# EAGLE design board (EAGLE 7.7.0)
CNAME: SCALE target board; CREVISION: A.1; DESIGNER: Daniel Page
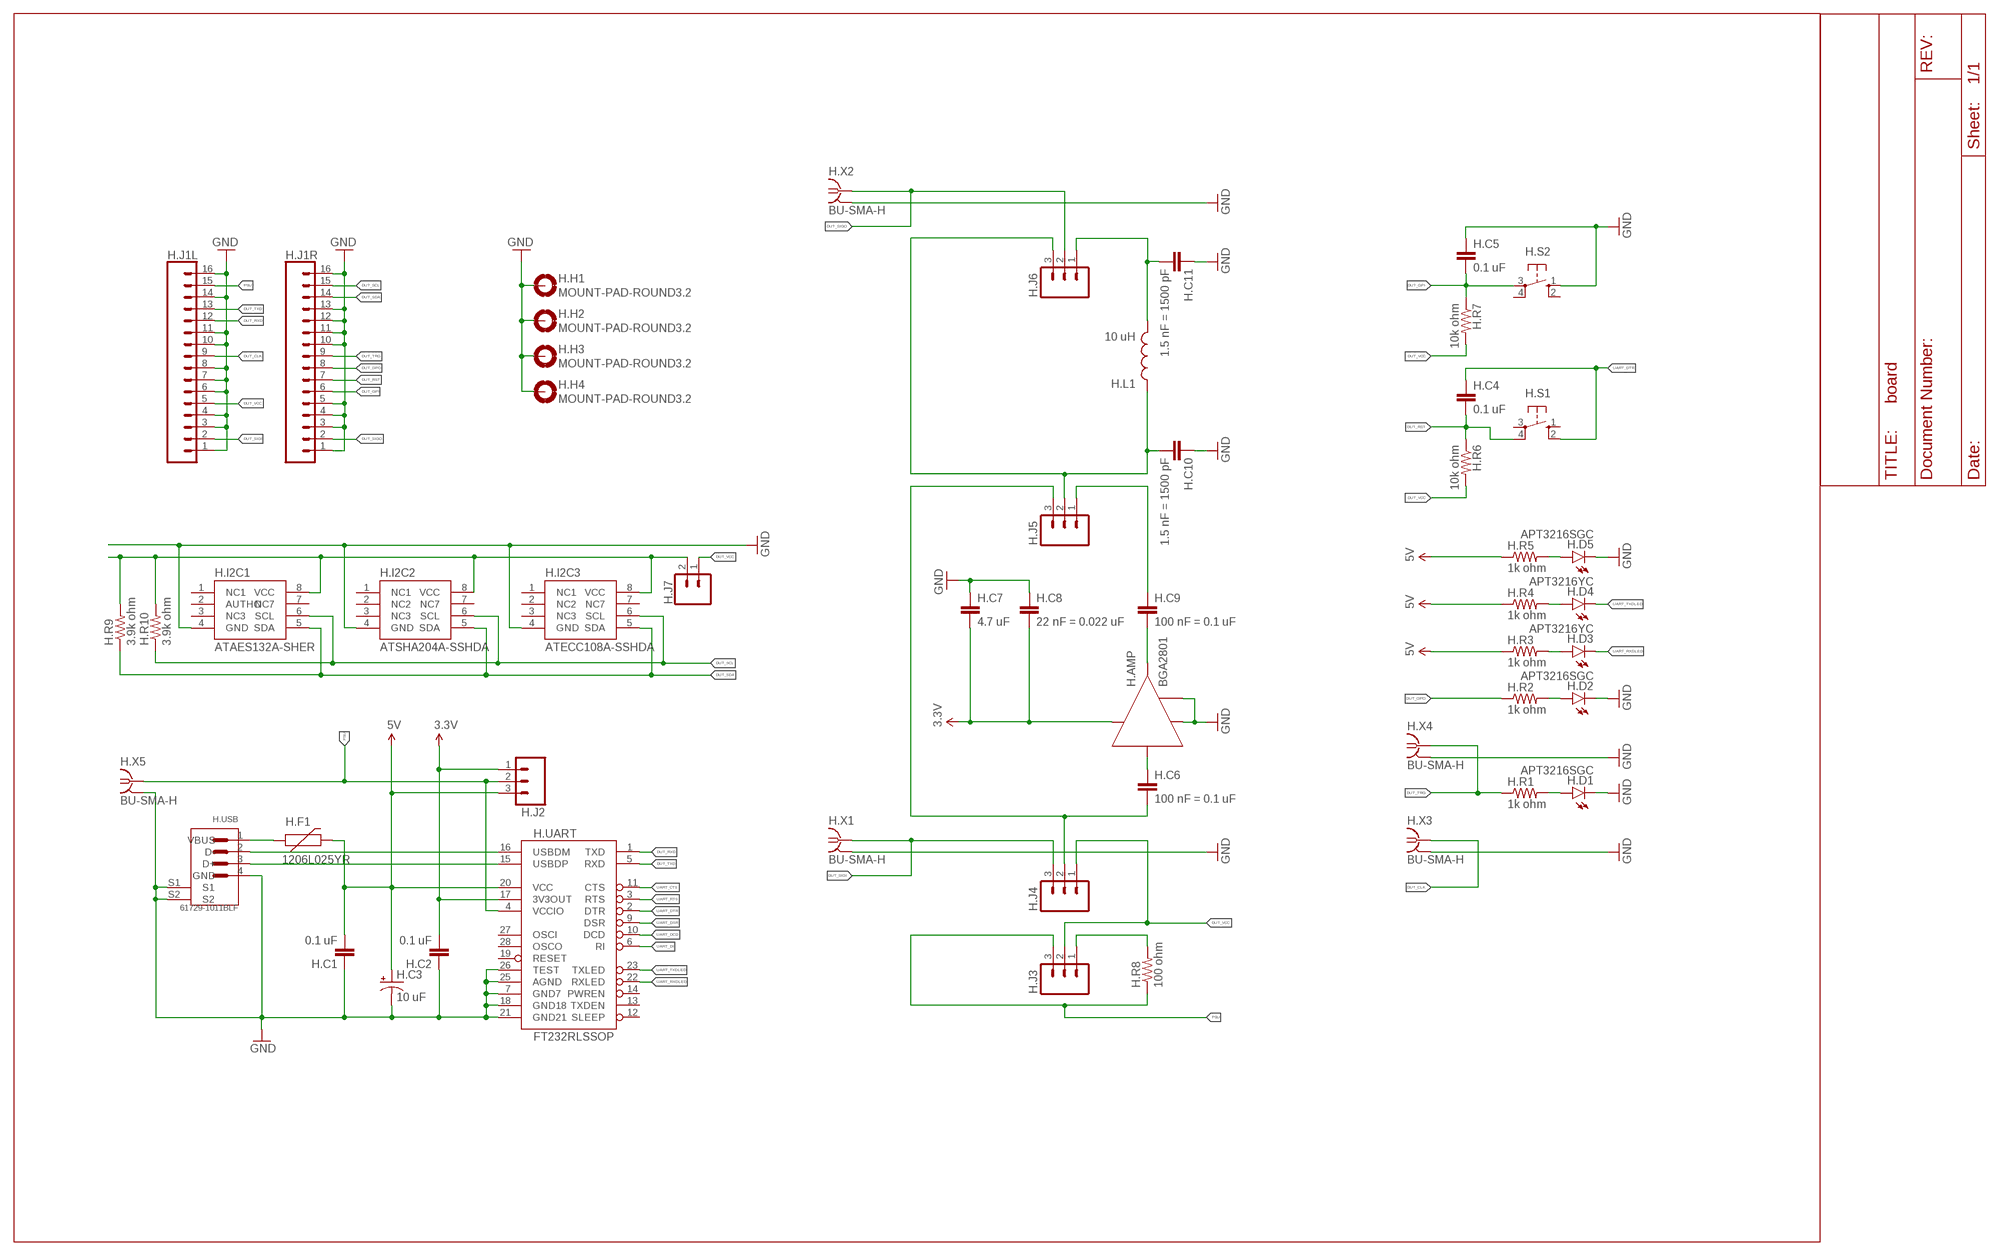
[diagram p0: schematic, sheet 1]

## Parts
H.AMP  BGA2801  [SOT363]
H.C1  0.1 uF  CAP0603-CAP  [0603-CAP]
H.C2  0.1 uF  CAP0603-CAP  [0603-CAP]
H.C3  10 uF  CAP_POL1206  [EIA3216]
H.C4  0.1 uF  CAP0603-CAP  [0603-CAP]
H.C5  0.1 uF  CAP0603-CAP  [0603-CAP]
H.C6  100 nF = 0.1 uF  CAP0603-CAP  [0603-CAP]
H.C7  4.7 uF  CAP0603-CAP  [0603-CAP]
H.C8  22 nF = 0.022 uF  CAP0603-CAP  [0603-CAP]
H.C9  100 nF = 0.1 uF  CAP0603-CAP  [0603-CAP]
H.C10  1.5 nF = 1500 pF  CAP0603-CAP  [0603-CAP]
H.C11  1.5 nF = 1500 pF  CAP0603-CAP  [0603-CAP]
H.D1  APT3216SGC  LED-GREEN1206  [LED-1206]
H.D2  APT3216SGC  LED-GREEN1206  [LED-1206]
H.D3  APT3216YC  LED-YELLOW1206  [LED-1206]
H.D4  APT3216YC  LED-YELLOW1206  [LED-1206]
H.D5  APT3216SGC  LED-RED1206  [LED-1206]
H.F1  1206L025YR  PTCSMD  [PTC-1206]
H.H1  MOUNT-PAD-ROUND3.2  [3,2-PAD]
H.H2  MOUNT-PAD-ROUND3.2  [3,2-PAD]
H.H3  MOUNT-PAD-ROUND3.2  [3,2-PAD]
H.H4  MOUNT-PAD-ROUND3.2  [3,2-PAD]
H.I2C1  ATAES132A-SHER  ATAES132  [SO08]
H.I2C2  ATSHA204A-SSHDA  ATSHA204_SOIC8  [SO08]
H.I2C3  ATECC108A-SSHDA  ATECC108  [SO08]
H.J1L  CONN_16  [1X16]
H.J1R  CONN_16  [1X16]
H.J2  M03PTH  [1X03@1]
H.J3  M03PTH  [1X03@1]
H.J4  M03PTH  [1X03@1]
H.J5  M03PTH  [1X03@1]
H.J6  M03PTH  [1X03@1]
H.J7  CONN_02  [1X02]
H.L1  10 uH  INDUCTOR0603  [0603]
H.R1  1k ohm  RESISTOR0603-RES  [0603-RES]
H.R2  1k ohm  RESISTOR0603-RES  [0603-RES]
H.R3  1k ohm  RESISTOR0603-RES  [0603-RES]
H.R4  1k ohm  RESISTOR0603-RES  [0603-RES]
H.R5  1k ohm  RESISTOR0603-RES  [0603-RES]
H.R6  10k ohm  RESISTOR0603-RES  [0603-RES]
H.R7  10k ohm  RESISTOR0603-RES  [0603-RES]
H.R8  100 ohm  RESISTOR0603-RES  [0603-RES]
H.R9  3.9k ohm  RESISTOR0603-RES  [0603-RES]
H.R10  3.9k ohm  RESISTOR0603-RES  [0603-RES]
H.S1  40-XX  [B3F-40XX]
H.S2  40-XX  [B3F-40XX]
H.UART  FT232RLSSOP  [SSOP28DB]
H.USB  61729-1011BLF  [FCI_61729-1011BLF]
H.X1  BU-SMA-H  [BU-SMA-H]
H.X2  BU-SMA-H  [BU-SMA-H]
H.X3  BU-SMA-H  [BU-SMA-H]
H.X4  BU-SMA-H  [BU-SMA-H]
H.X5  BU-SMA-H  [BU-SMA-H]

## Nets
3.3V: H.AMP.1(VCC) H.C2.2 H.C7.2 H.C8.2 H.J2.1 H.UART.17(3V3OUT)
5V: H.C1.2 H.C3.A(+) H.F1.2 H.J2.3 H.R3.1 H.R4.1 H.R5.1 H.UART.20(VCC)
AMP: H.AMP.3(RF_OUT) H.C9.2
DUT_CLK: H.J1L.9 H.X3.1
DUT_GPI: H.C5.2 H.J1R.6 H.R7.1 H.S2.3(P)
DUT_GPO: H.J1R.8 H.R2.1
DUT_RST: H.C4.2 H.J1R.7 H.R6.1 H.S1.4(P1)
DUT_RXD: H.J1L.12 H.UART.1(TXD)
DUT_SCL: H.I2C1.6(SCL) H.I2C2.6(SCL) H.I2C3.6(SCL) H.J1R.15 H.R10.1
DUT_SDA: H.I2C1.5(SDA) H.I2C2.5(SDA) H.I2C3.5(SDA) H.J1R.14 H.R9.1
DUT_SIGI: H.J1L.2 H.J4.3 H.X1.1
DUT_SIGO: H.J1R.2 H.J6.2 H.X2.1
DUT_TRG: H.J1R.9 H.R1.1 H.X4.1
DUT_TXD: H.J1L.13 H.UART.5(RXD)
DUT_VCC: H.J1L.5 H.J3.2 H.J4.1 H.J7.1 H.R6.2 H.R7.2
GND: H.AMP.2(GND2) H.AMP.4(GND1) H.AMP.5(GND2) H.C1.1 H.C2.1 H.C3.C(-) H.C5.1 H.C7.1 H.C8.1 H.C10.1 H.C11.1 H.D1.C H.D2.C H.D5.C H.H1.B3,2(MOUNT) H.H2.B3,2(MOUNT) H.H3.B3,2(MOUNT) H.H4.B3,2(MOUNT) H.I2C1.4(GND) H.I2C2.4(GND) H.I2C3.4(GND) H.J1L.1 H.J1L.3 H.J1L.4 H.J1L.6 H.J1L.7 H.J1L.8 H.J1L.10 H.J1L.11 H.J1L.14 H.J1L.16 H.J1R.1 H.J1R.3 H.J1R.4 H.J1R.5 H.J1R.10 H.J1R.11 H.J1R.12 H.J1R.13 H.J1R.16 H.S2.1(S) H.UART.7(GND7) H.UART.18(GND18) H.UART.21(GND21) H.UART.25(AGND) H.UART.26(TEST) H.USB.4(GND) H.USB.S1 H.USB.S2 H.X1.2 H.X1.3 H.X1.4 H.X1.5 H.X2.2 H.X2.3 H.X2.4 H.X2.5 H.X3.2 H.X3.3 H.X3.4 H.X3.5 H.X4.2 H.X4.3 H.X4.4 H.X4.5 H.X5.2 H.X5.3 H.X5.4 H.X5.5
N$1: H.D5.A H.R5.2
N$2: H.D4.A H.R4.2
N$3: H.D3.A H.R3.2
N$6: H.D1.A H.R1.2
N$7: H.D2.A H.R2.2
N$9: H.UART.16(USBDM) H.USB.2(D-)
N$10: H.UART.15(USBDP) H.USB.3(D+)
N$13: H.C9.1 H.J5.1
N$14: H.C11.2 H.J6.1 H.L1.2
N$15: H.C10.2 H.J5.2 H.J6.3 H.L1.1
N$16: H.J3.1 H.R8.2
N$18: H.F1.1 H.USB.1(VBUS)
N$19: H.I2C1.8(VCC) H.I2C2.8(VCC) H.I2C3.8(VCC) H.J7.2 H.R9.2 H.R10.2
N$21: H.AMP.6(RF_IN) H.C6.1
N$25: H.C6.2 H.J4.2 H.J5.3
PSU: H.J1L.15 H.J2.2 H.J3.3 H.R8.1 H.UART.4(VCCIO) H.X5.1
UART_CTS: H.UART.11(CTS)
UART_DCD: H.UART.10(DCD)
UART_DI: H.UART.6(RI)
UART_DSR: H.UART.9(DSR)
UART_DTR: H.C4.1 H.S1.2(S1) H.UART.2(DTR)
UART_RTS: H.UART.3(RTS)
UART_RXDLED: H.D3.C H.UART.22(RXLED)
UART_TXDLED: H.D4.C H.UART.23(TXLED)
Unconnected: H.I2C1.1(NC1) H.I2C1.2(AUTHO) H.I2C1.3(NC3) H.I2C1.7(NC7) H.I2C2.1(NC1) H.I2C2.2(NC2) H.I2C2.3(NC3) H.I2C2.7(NC7) H.I2C3.1(NC1) H.I2C3.2(NC2) H.I2C3.3(NC3) H.I2C3.7(NC7) H.S1.1(S) H.S1.3(P) H.S2.2(S1) H.S2.4(P1) H.UART.12(SLEEP) H.UART.13(TXDEN) H.UART.14(PWREN) H.UART.19(RESET) H.UART.27(OSCI) H.UART.28(OSCO)

## Library data of the parts
H.AMP = board:BGA2801
H.C1 H.C2 H.C4-H.C11 = SparkFun-Capacitors:CAP: Capacitor Standard 0603 ceramic capacitor, and 0.1" leaded capacitor.
H.C3 = SparkFun-Capacitors:CAP_POL: Capacitor Polarized These are standard SMD and PTH capacitors. Normally 10uF, 47uF, and 100uF in electrolytic and tantalum varieties. Always verify the external diameter of the through hole cap, it varies with capacity, voltage, and manufacturer. The EIA devices should be standard.
H.D1 H.D2 = SparkFun-LED:LED-GREEN: Various green LEDs Green LEDs used in SFE Production 0603- DIO-00821 LARGE- DIO-00862 LILYPAD- DIO-09910; PROD_ID: DIO-00862; VALUE: GREEN
H.D3 H.D4 = SparkFun-LED:LED-YELLOW: Yellow SMD LEDs LilyPad 1206- DIO-09909 0603- DIO-09003 "SMART" means more efficient and expensive; PROD_ID: DIO-00820; VALUE: YELLOW
H.D5 = SparkFun-LED:LED-RED: Assorted Red LEDs LilyPad 1206- DIO-09912 1206- DIO-00809 0603- DIO-00819 "SMART" means more efficient and expensive; PROD_ID: DIO-09912; VALUE: RED
H.F1 = SparkFun-PowerIC:PTC: Resettable Fuse PTC Resettable Fuse. Spark Fun Electronics SKU : COM-08357; PROD_ID: RES-11150
H.H1-H.H4 = holes:MOUNT-PAD-ROUND: MOUNTING PAD, round
H.I2C1 = SparkFun-IC-Special-Function:ATAES132: Crypto 32Kb Serial EEPROM AES-128-CCM MAC Secure Storage for 128-bit keys Encrypted User Memory Readn and Write HWRNG 2.5V to 5.5V Datasheet <https://cdn.sparkfun.com/datasheets/Dev/Beagle/Atmel-8760-CryptoAuth-ATAES132-Datasheet.pdf> SparkFun Products CryptoCape <https://www.sparkfun.com/products/12773> (DEV-12773) SparkFun CryptoShield <https://www.sparkfun.com/products/13183> (DEV-13183); PROD_ID: IC-11983; VALUE: ATAES132
H.I2C2 = SparkFun-IC-Special-Function:ATSHA204_SOIC8: Crypto 4.5KB I2C Datasheet <https://cdn.sparkfun.com/datasheets/Dev/Beagle/Atmel-8740-CryptoAuth-ATSHA204-Datasheet.pdf> SparkFun Products CryptoCape <https://www.sparkfun.com/products/12773> (DEV-12773) SparkFun CryptoShield <https://www.sparkfun.com/products/13183> (DEV-13183); PROD_ID: IC-11981; VALUE: ATSHA204
H.I2C3 = SparkFun-IC-Special-Function:ATECC108: ATECC108 ECDSA with NIST ATECC108: Provides ECDSA with NIST curves P256, B283, and K283. Also, a RNG, 8.5Kb EEPROM. 2.0V - 5.5V. Datasheet <https://cdn.sparkfun.com/datasheets/Dev/Beagle/Atmel-8873S-CryptoAuth-ATECC108-Datasheet-Summary.pdf> SparkFun Products CryptoCape <https://www.sparkfun.com/products/12773> (DEV-12773) SparkFun CryptoShield <https://www.sparkfun.com/products/13183> (DEV-13183); PROD_ID: IC-11982; VALUE: ATECC108
H.J1L H.J1R = SparkFun-Connectors:CONN_16: Multi connection point. Often used as Generic Header-pin footprint for 0.1 inch spaced/style header connections On any of the 0.1 inch spaced packages, you can populate with these: Break Away Headers - Straight <https://www.sparkfun.com/products/116> (PRT-00116) Break Away Male Headers - Right Angle <https://www.sparkfun.com/products/553> (PRT-00553) Female Headers <https://www.sparkfun.com/products/115> (PRT-00115) Break Away Headers - Machine Pin <https://www.sparkfun.com/products/117> (PRT-00117) Break Away Female Headers - Swiss Machine Pin <https://www.sparkfun.com/products/743> (PRT-00743) For SCREWTERMINALS and SPRING TERMINALS visit here: Screw Terimnals on SparkFun.com <https://www.sparkfun.com/search/results?term=Screw+Terminals> (5mm/3.5mm/2.54mm spacing) This device is also useful as a general connection point to wire up your design to another part of your project. Our various solder wires solder well into these plated through hole pads. Hook-Up Wire - Assortment (Stranded, 22 AWG) <https://www.sparkfun.com/products/11375> (PRT-11375) Hook-Up Wire - Assortment (Solid Core, 22 AWG) <https://www.sparkfun.com/products/11367> (PRT-11367) View the entire wire category on our website here <https://www.sparkfun.com/categories/141> Special notes: Molex polarized connector foot print use with SKU : PRT-08231 with associated crimp pins and housings. 1MM SMD Version SKU: PRT-10208 NOTES ON THE VARIANTS LOCK and LOCK_LONGPADS... This footprint was designed to help hold the alignment of a through-hole component (i.e. 6-pin header) while soldering it into place. You may notice that each hole has been shifted either up or down by 0.005 of an inch from it's more standard position (which is a perfectly straight line). This slight alteration caused the pins (the squares in the middle) to touch the edges of the holes. Because they are alternating, it causes a "brace" to hold the component in place. 0.005 has proven to be the perfect amount of "off-center" position when using our standard breakaway headers. Although looks a little odd when you look at the bare footprint, once you have a header in there, the alteration is very hard to notice. Also,if you push a header all the way into place, it is covered up entirely on the bottom side.
H.J2-H.J6 = SparkFun-Connectors:M03: Header 3 Standard 3-pin 0.1" header. Use with straight break away headers (SKU : PRT-00116), right angle break away headers (PRT-00553), swiss pins (PRT-00743), machine pins (PRT-00117), and female headers (PRT-00115). Molex polarized connector foot print use with SKU : PRT-08232 with associated crimp pins and housings.
H.J7 = SparkFun-Connectors:CONN_02: Multi connection point. Often used as Generic Header-pin footprint for 0.1 inch spaced/style header connections On any of the 0.1 inch spaced packages, you can populate with these: Break Away Headers - Straight <https://www.sparkfun.com/products/116> (PRT-00116) Break Away Male Headers - Right Angle <https://www.sparkfun.com/products/553> (PRT-00553) Female Headers <https://www.sparkfun.com/products/115> (PRT-00115) Break Away Headers - Machine Pin <https://www.sparkfun.com/products/117> (PRT-00117) Break Away Female Headers - Swiss Machine Pin <https://www.sparkfun.com/products/743> (PRT-00743) For SCREWTERMINALS and SPRING TERMINALS visit here: Screw Terimnals on SparkFun.com <https://www.sparkfun.com/search/results?term=Screw+Terminals> (5mm/3.5mm/2.54mm spacing) This device is also useful as a general connection point to wire up your design to another part of your project. Our various solder wires solder well into these plated through hole pads. Hook-Up Wire - Assortment (Stranded, 22 AWG) <https://www.sparkfun.com/products/11375> (PRT-11375) Hook-Up Wire - Assortment (Solid Core, 22 AWG) <https://www.sparkfun.com/products/11367> (PRT-11367) View the entire wire category on our website here <https://www.sparkfun.com/categories/141> Special notes: Molex polarized connector foot print use with: PRT-08233 with associated crimp pins and housings. 2.54_SCREWTERM for use with PRT-10571. 3.5mm Screw Terminal footprints for PRT-08084 5mm Screw Terminal footprints for use with PRT-08432
H.L1 = SparkFun-Passives:INDUCTOR: Inductors Basic Inductor/Choke - 0603 and 1206. Footprints are not proven and vary greatly between part numbers. INDUCTOR POWER 3.3UH 4.0A SMD 0.197" L x 0.197" W x 0.177" H (5.00mm x 5.00mm x 4.50mm)
H.R1-H.R10 = SparkFun-Passives:RESISTOR: Resistor Basic schematic elements and footprints for 0603, 1206, and PTH resistors.
H.S1 H.S2 = switch-omron:40-XX: OMRON SWITCH; MF: OMRON COMPONENTS USA; MPN: B3F-4000; OC_FARNELL: 176434; OC_NEWARK: 36K3105
H.UART = SparkFun-DigitalIC:FT232RL: USB UART FT232RL 4th Generation USB UART (USB <-> Serial) Controller. Spark Fun Electronics SKU : COM-00650 Production SKU IC-00870; PROD_ID: IC-00870
H.USB = Octopart-CPL:61729-1011BLF: Conn USB Type B RCP 4 POS 2.5mm Solder RA Thru-Hole 4 Terminal 1 Port Tube; MANUFACTURER: Framatome
H.X1-H.X5 = con-coax:BU-SMA-H: FEMALE SMA CONNECTOR Radiall; OC_FARNELL: unknown; OC_NEWARK: unknown

## Board
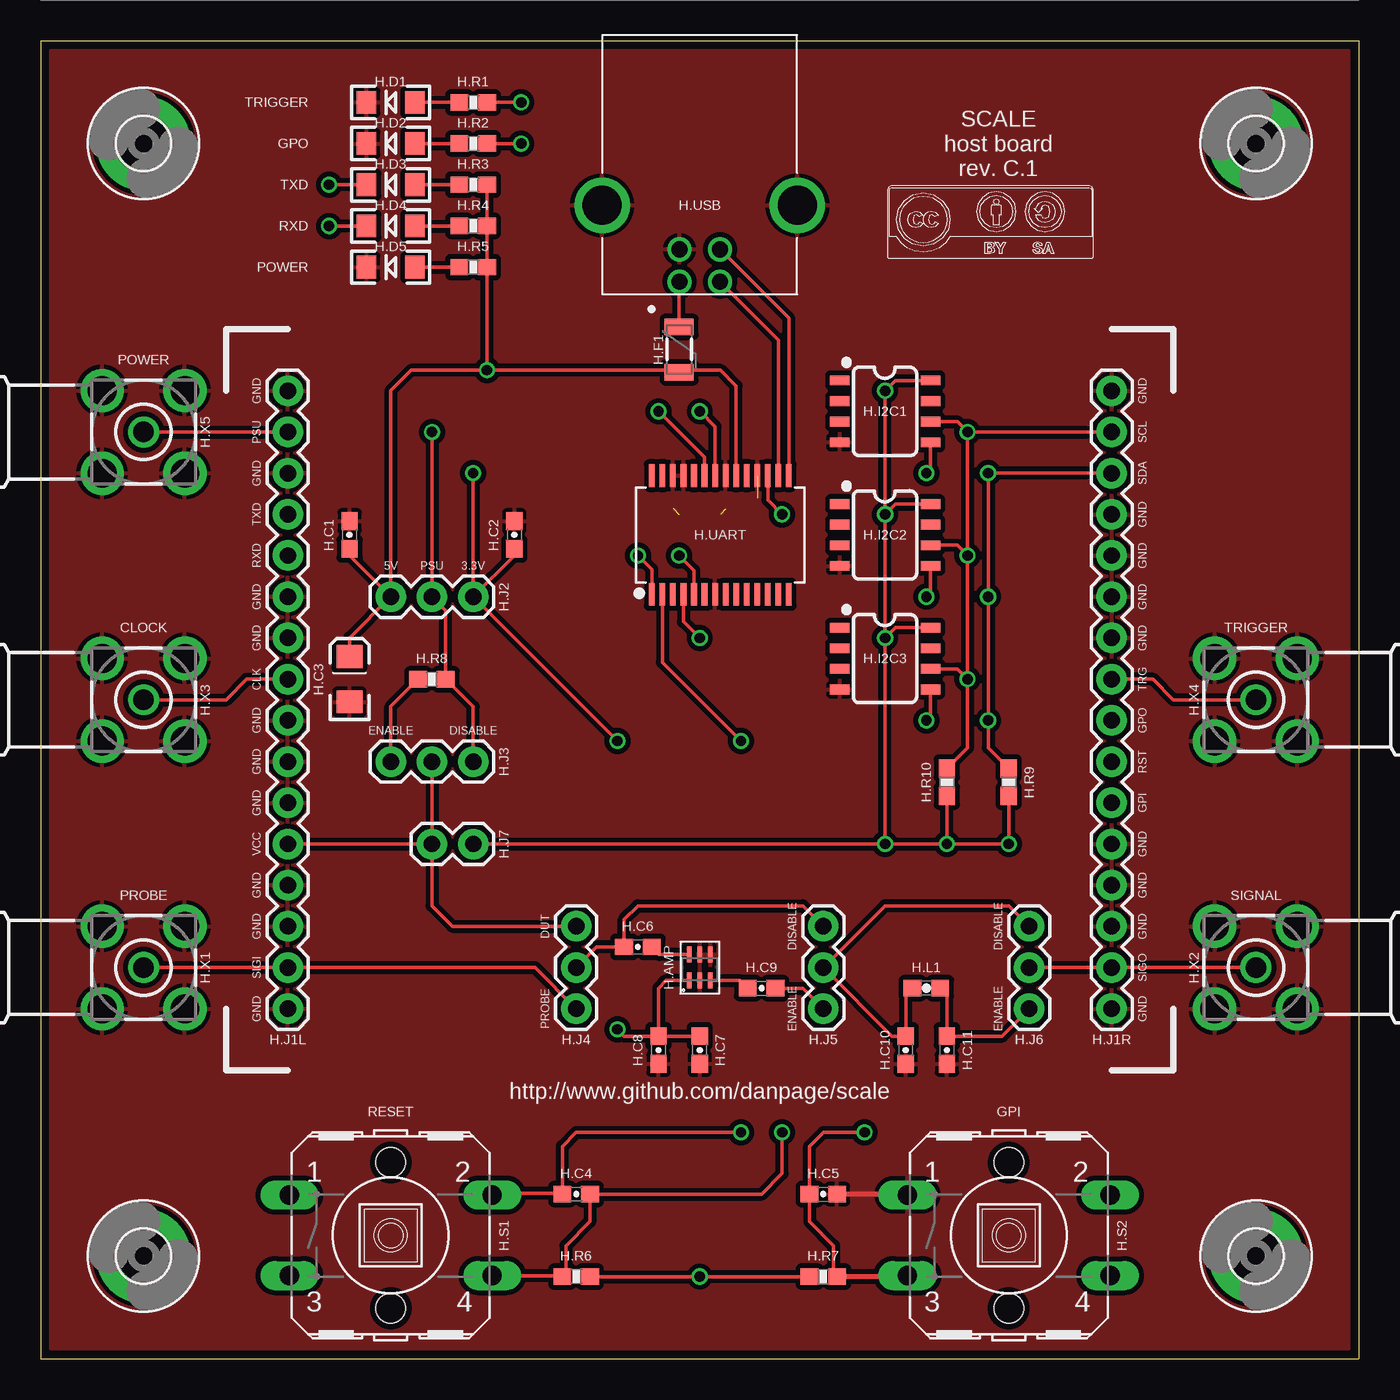
[diagram p1: board, top side]
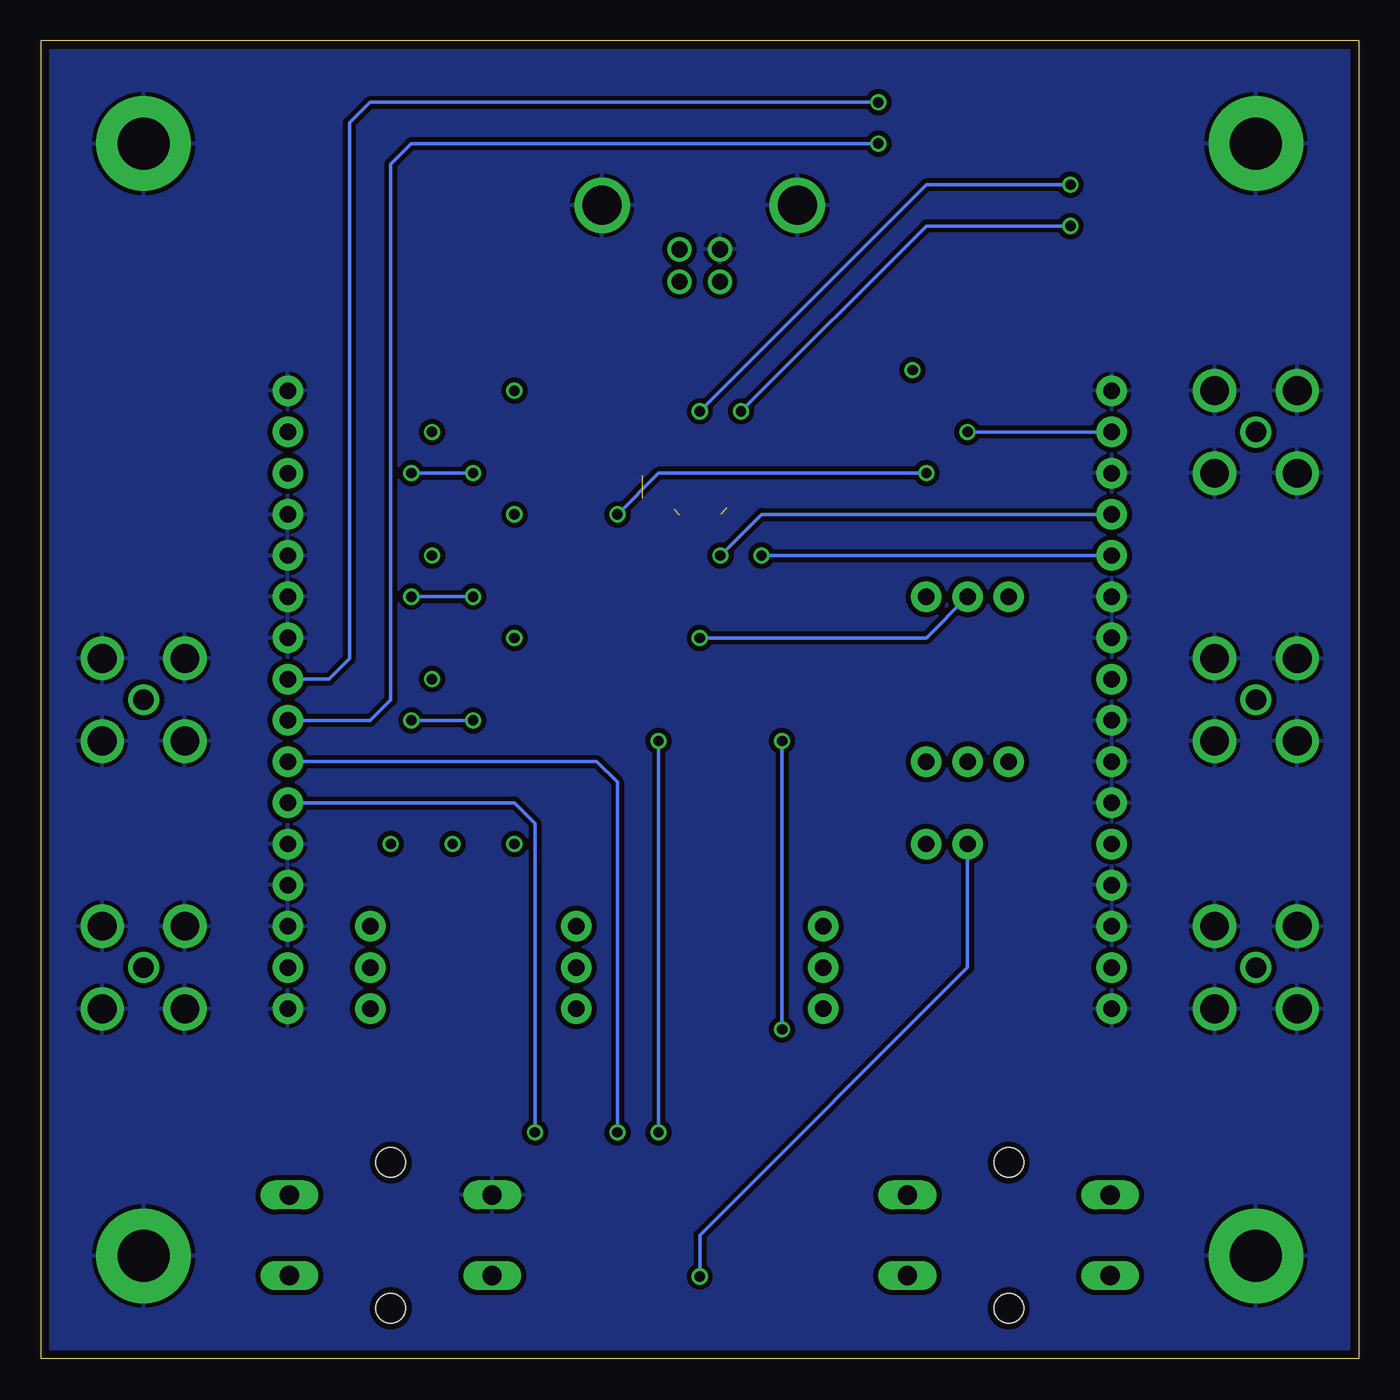
[diagram p2: board, bottom side, seen from below]

Size 81.28 x 81.28 mm. Coordinates in mm from the lower left corner, seen from the top.
Outline: 0,81.28 81.28,81.28 81.28,0 0,0 0,81.28
Copper layers (1*16): Top 0.0356mm / dielectric 1.5011mm / Bottom 0.0356mm
Design rules "oshpark-2layer": minimum track width 6mil, minimum drill 13mil, track to track 6mil, track to pad 6mil, pad to pad 6mil, via to via 6mil, smd to smd 6mil, copper to edge 15mil, drill to drill 6mil, minimum pad ring 7mil, minimum via ring 7mil, stop-mask expansion 2.5mil, vias tented up to drill 0mil, thermal gap 10mil

### Footprints (pad centres in the part's own frame; a part is rotated, then mirrored left to right if it is on the bottom)
SOT363 = smd 0.3 x 0.99: 1 -0.65,-0.8; 2 0,-0.8; 3 0.65,-0.8; 4 0.65,0.81; 5 0,0.81; 6 -0.65,0.81
0603-CAP = smd 1.1 x 1: 1 -0.85,0; 2 0.85,0
EIA3216 = smd 1.4 x 1.6: A 1.4,0; C -1.4,0
LED-1206 = smd 1.2 x 1.4: A -1.5,0; C 1.5,0
PTC-1206 = smd 1 x 1.8: 1 -1.4,0; 2 1.4,0
3,2-PAD = drill 3.2 pad 5.842: B3,2 0,0
SO08 = smd 0.6 x 1.2: 1 -1.905,-2.8; 2 -0.635,-2.8; 3 0.635,-2.8; 4 1.905,-2.8; 5 1.905,2.8; 6 0.635,2.8; 7 -0.635,2.8; 8 -1.905,2.8
1X16 = drill 1.016 pad 1.88: 1 0,0; 2 2.54,0; 3 5.08,0; 4 7.62,0; 5 10.16,0; 6 12.7,0; 7 15.24,0; 8 17.78,0; 9 20.32,0; 10 22.86,0; 11 25.4,0; 12 27.94,0; 13 30.48,0; 14 33.02,0; 15 35.56,0; 16 38.1,0
1X03@1 = drill 1.016 pad 1.88: 1 0,0; 2 2.54,0; 3 5.08,0
1X02 = drill 1.016 pad 1.88: 1 0,0; 2 2.54,0
0603 = smd 1.1 x 1: 1 -0.85,0; 2 0.85,0
0603-RES = smd 1.1 x 1: 1 -0.85,0; 2 0.85,0
B3F-40XX = drill 1.194 long: 1 -6.248,2.489; 2 6.248,2.489; 3 -6.248,-2.489; 4 6.248,-2.489 | hole 1.803: 0,-4.496; 0,4.496
SSOP28DB = smd 0.348 x 1.397: 1 -4.225,-3.656; 2 -3.575,-3.656; 3 -2.925,-3.656; 4 -2.275,-3.656; 5 -1.625,-3.656; 6 -0.975,-3.656; 7 -0.325,-3.656; 8 0.325,-3.656; 9 0.975,-3.656; 10 1.625,-3.656; 11 2.275,-3.656; 12 2.925,-3.656; 13 3.575,-3.656; 14 4.225,-3.656; 15 4.225,3.656; 16 3.575,3.656; 17 2.925,3.656; 18 2.275,3.656; 19 1.625,3.656; 20 0.975,3.656; 21 0.325,3.656; 22 -0.325,3.656; 23 -0.975,3.656; 24 -1.625,3.656; 25 -2.275,3.656; 26 -2.925,3.656; 27 -3.575,3.656; 28 -4.225,3.656
FCI_61729-1011BLF = drill 1: 1 -1.25,-4.71; 2 1.25,-4.71; 3 1.25,-2.71; 4 -1.25,-2.71 | drill 2.4: S1 -6.02,0; S2 6.02,0
BU-SMA-H = drill 1.27: 1 0,0 | drill 1.778: 2 -2.55,2.55; 3 2.55,2.55; 4 2.55,-2.55; 5 -2.55,-2.55

### Placement (x,y rotation side)
H.AMP  40.64,24.13 0 top
H.C1  19.05,50.8 270 top
H.C2  29.21,50.8 270 top
H.C3  19.05,41.91 90 top
H.C4  33.02,10.16 0 top
H.C5  48.26,10.16 180 top
H.C6  36.83,25.4 180 top
H.C7  40.64,19.05 90 top
H.C8  38.1,19.05 90 top
H.C9  44.45,22.86 180 top
H.C10  53.34,19.05 90 top
H.C11  55.88,19.05 90 top
H.D1  21.59,77.47 180 top
H.D2  21.59,74.93 180 top
H.D3  21.59,72.39 180 top
H.D4  21.59,69.85 180 top
H.D5  21.59,67.31 180 top
H.F1  39.37,62.23 270 top
H.H1  74.93,74.93 270 top
H.H2  6.35,74.93 270 top
H.H3  74.93,6.35 270 top
H.H4  6.35,6.35 270 top
H.I2C1  52.07,58.42 270 top
H.I2C2  52.07,50.8 270 top
H.I2C3  52.07,43.18 270 top
H.J1L  15.24,21.59 90 top
H.J1R  66.04,21.59 90 top
H.J2  26.67,46.99 180 top
H.J3  21.59,36.83 0 top
H.J4  33.02,26.67 270 top
H.J5  48.26,21.59 90 top
H.J6  60.96,21.59 90 top
H.J7  24.13,31.75 0 top
H.L1  54.61,22.86 0 top
H.R1  26.67,77.47 180 top
H.R2  26.67,74.93 180 top
H.R3  26.67,72.39 180 top
H.R4  26.67,69.85 180 top
H.R5  26.67,67.31 180 top
H.R6  33.02,5.08 0 top
H.R7  48.26,5.08 180 top
H.R8  24.13,41.91 180 top
H.R9  59.69,35.56 270 top
H.R10  55.88,35.56 270 top
H.S1  21.59,7.62 0 top
H.S2  59.69,7.62 0 top
H.UART  41.91,50.8 0 top
H.USB  40.64,71.12 0 top
H.X1  6.35,24.13 180 top
H.X2  74.93,24.13 0 top
H.X3  6.35,40.64 180 top
H.X4  74.93,40.64 0 top
H.X5  6.35,57.15 180 top

### Tracks (layer width: path | path; a pad name or v marks a point on that pad's centre or on a via)
3.3V  (via drill 0.64)
  Top 0.203: H.UART.17 44.84,52.95 v45.72,52.07 | v26.67,54.61 H.J2.1 | H.J2.1 29.21,49.53 H.C2.2 | v35.56,38.1 H.J2.1 | H.AMP.1 38.57,23.33 38.1,22.86 H.C8.2 | H.C7.2 H.C8.2 | H.C8.2 35.98,19.9 v35.56,20.32
  Bottom 0.203: v26.67,54.61 43.18,54.61 v45.72,52.07 | v35.56,38.1 v35.56,20.32
5V  (via drill 0.64)
  Top 0.203: H.UART.20 42.88,59.98 41.91,60.96 39.5,60.96 | 39.24,60.96 v27.52,60.96 | v27.52,60.96 H.R5.1 H.R4.1 H.R3.1 | v27.52,60.96 22.86,60.96 21.59,59.69 H.J2.3 | H.J2.3 19.05,49.53 H.C1.2 | H.C3.A 19.05,44.45 H.J2.3
  Top 0.305: 39.5,60.96 H.F1.2 | H.J2.3 21.46,46.99
  Top 0.406: 39.24,60.96 H.F1.2
AMP
  Top 0.203: H.AMP.3 43.13,23.33 H.C9.2
DUT_CLK
  Top 0.203: H.X3.1 11.43,40.64 12.7,41.91 H.J1L.9
DUT_GPI  (via drill 0.64)
  Top 0.203: v50.8,13.97 48.26,13.97 47.41,13.12 H.C5.2 47.41,8.47 48.9,6.99 48.9,5.29 H.R7.1
  Top 0.305: 53.39,5.08 H.R7.1
  Top 0.406: 53.39,5.08 H.S2.3
  Bottom 0.203: H.J1R.6 52.07,34.29 50.8,33.02 v50.8,13.97
DUT_GPO  (via drill 0.64)
  Top 0.203: H.R2.1 v29.63,74.93
  Bottom 0.203: v29.63,74.93 58.42,74.93 59.69,73.66 59.69,40.64 60.96,39.37 H.J1R.8
DUT_RST  (via drill 0.64)
  Top 0.203: v45.72,13.97 45.72,11.43 44.45,10.16 H.C4.2 33.87,8.47 32.38,6.99 32.38,5.29 H.R6.1 | 32.12,5.13 H.S1.4
  Top 0.406: 32.12,5.13 H.R6.1
  Bottom 0.203: H.J1R.7 46.99,36.83 45.72,35.56 v45.72,13.97
DUT_RXD  (via drill 0.64)
  Top 0.203: H.UART.1 37.69,48.67 v36.83,49.53
  Bottom 0.203: v36.83,49.53 H.J1L.12
DUT_SCL  (via drill 0.64)
  Top 0.203: v57.15,41.91 57.15,37.68 H.R10.1 | H.I2C3.6 56.52,42.55 v57.15,41.91 | v57.15,49.53 v57.15,41.91 | v57.15,57.15 v57.15,49.53 | H.I2C2.6 56.52,50.16 v57.15,49.53 | H.I2C1.6 56.52,57.78 v57.15,57.15 | v57.15,57.15 H.J1R.15
DUT_SDA  (via drill 0.64)
  Top 0.203: H.R9.1 58.42,37.68 v58.42,39.37 v58.42,46.99 v58.42,54.61 H.J1R.14 | H.I2C1.5 54.87,54.87 v54.61,54.61 | H.I2C2.5 54.87,47.25 v54.61,46.99 | H.I2C3.5 54.87,39.63 v54.61,39.37
  Bottom 0.203: v58.42,54.61 v54.61,54.61 | v58.42,46.99 v54.61,46.99 | v58.42,39.37 v54.61,39.37
DUT_SIGI
  Top 0.203: H.X1.1 H.J1L.2 30.48,24.13 H.J4.3
DUT_SIGO
  Top 0.203: H.X2.1 H.J1R.2 H.J6.2
DUT_TRG  (via drill 0.64)
  Top 0.203: H.X4.1 69.85,40.64 68.58,41.91 H.J1R.9 | H.R1.1 v29.63,77.47
  Bottom 0.203: H.J1R.9 63.5,41.91 62.23,43.18 62.23,76.2 60.96,77.47 v29.63,77.47
DUT_TXD  (via drill 0.64)
  Top 0.203: H.UART.5 40.28,48.62 v39.37,49.53
  Bottom 0.203: v39.37,49.53 36.83,52.07 H.J1L.13
DUT_VCC  (via drill 0.64)
  Top 0.203: H.J1L.5 H.J7.1 | H.J3.2 H.J7.1 | H.J7.1 24.13,27.94 25.4,26.67 H.J4.1 | H.R7.2 v40.64,5.08 H.R6.2
  Bottom 0.203: H.J7.1 24.13,24.13 40.64,7.62 v40.64,5.08
GND  (3 unrouted)
  Top 0.305: 53.39,10.16 H.C5.1
  Top 0.406: 53.39,10.16 H.S2.1
  pour Bottom (isolate 0.305): 80.64,80.64 0.64,80.64 0.64,0.64 80.64,0.64
  pour Top (isolate 0.305): 80.64,80.64 0.64,80.64 0.64,0.64 80.64,0.64
N$1
  Top 0.203: H.D5.A H.R5.2
N$2
  Top 0.203: H.D4.A H.R4.2
N$3
  Top 0.203: H.D3.A H.R3.2
N$6
  Top 0.203: H.D1.A H.R1.2
N$7
  Top 0.203: H.D2.A H.R2.2
N$9
  Top 0.203: H.UART.16 45.48,62.81 H.USB.2
N$10
  Top 0.203: H.UART.15 46.13,64.17 H.USB.3
N$13
  Top 0.203: H.C9.1 46.99,22.86 H.J5.1
N$14
  Top 0.203: H.J6.1 59.27,19.9 H.C11.2 55.88,22.44 H.L1.2
N$15
  Top 0.203: H.L1.1 53.34,22.44 H.C10.2 52.49,19.9 H.J5.2 52.07,27.94 59.69,27.94 H.J6.3
N$16
  Top 0.203: H.J3.1 21.59,40.22 H.R8.2
N$18
  Top 0.203: H.F1.1 39.37,66.39 H.USB.1
N$19  (via drill 0.64)
  Top 0.203: H.J7.2 v52.07,31.75 | v52.07,31.75 v52.07,44.45 | v52.07,44.45 v52.07,52.07 | v52.07,52.07 v52.07,59.69 52.7,60.33 H.I2C1.8 | v52.07,52.07 52.7,52.7 H.I2C2.8 | v52.07,44.45 52.7,45.09 H.I2C3.8 | v52.07,31.75 v55.88,31.75 | v55.88,31.75 v59.69,31.75 H.R9.2 | v55.88,31.75 H.R10.2
N$21
  Top 0.203: H.AMP.6 38.14,24.94 H.C6.1
N$25
  Top 0.203: H.J4.2 34.29,25.4 H.C6.2 35.98,27.09 36.83,27.94 46.99,27.94 H.J5.3
PSU  (via drill 0.64)
  Top 0.203: H.X5.1 H.J1L.15 | v24.13,57.15 H.J2.2 24.98,46.14 H.R8.1 26.67,40.22 H.J3.3 | H.UART.4 39.63,45.45 v40.64,44.45
  Bottom 0.203: H.J1L.15 v24.13,57.15 | H.J2.2 26.67,44.45 v40.64,44.45
UART_DTR  (via drill 0.64)
  Top 0.203: H.UART.2 38.34,42.95 v43.18,38.1 | H.C4.1 32.17,13.12 33.02,13.97 v43.18,13.97 | 32.12,10.21 27.94,10.21 H.S1.2
  Top 0.305: 32.12,10.21 H.C4.1
  Bottom 0.203: v43.18,38.1 v43.18,13.97
UART_RXDLED  (via drill 0.64)
  Top 0.203: H.D3.C v17.78,72.39 | H.UART.22 41.59,57.48 v40.64,58.42
  Bottom 0.203: v17.78,72.39 26.67,72.39 v40.64,58.42
UART_TXDLED  (via drill 0.64)
  Top 0.203: H.D4.C v17.78,69.85 | H.UART.23 40.94,55.59 v38.1,58.42
  Bottom 0.203: v17.78,69.85 26.67,69.85 v38.1,58.42

### Text on the board
tPlace: TRIGGER | GPO | SCALE / host board / rev. C.1 | TXD | RXD | POWER | POWER | GND | GND | PSU | SCL | GND | SDA | TXD | GND | RXD | GND | 5V | PSU | 3.3V | GND | GND | CLOCK | TRIGGER | GND | GND | CLK | TRG | GND | ENABLE | DISABLE | GPO | GND | RST | GND | GPI | VCC | GND | PROBE | GND | GND | SIGNAL | GND | DUT | DISABLE | DISABLE | GND | SIGI | SIGO | GND | PROBE | ENABLE | ENABLE | GND | http://www.github.com/danpage/scale | RESET | GPI